# Altium schematic sheet BarGraph.SchDoc
size A
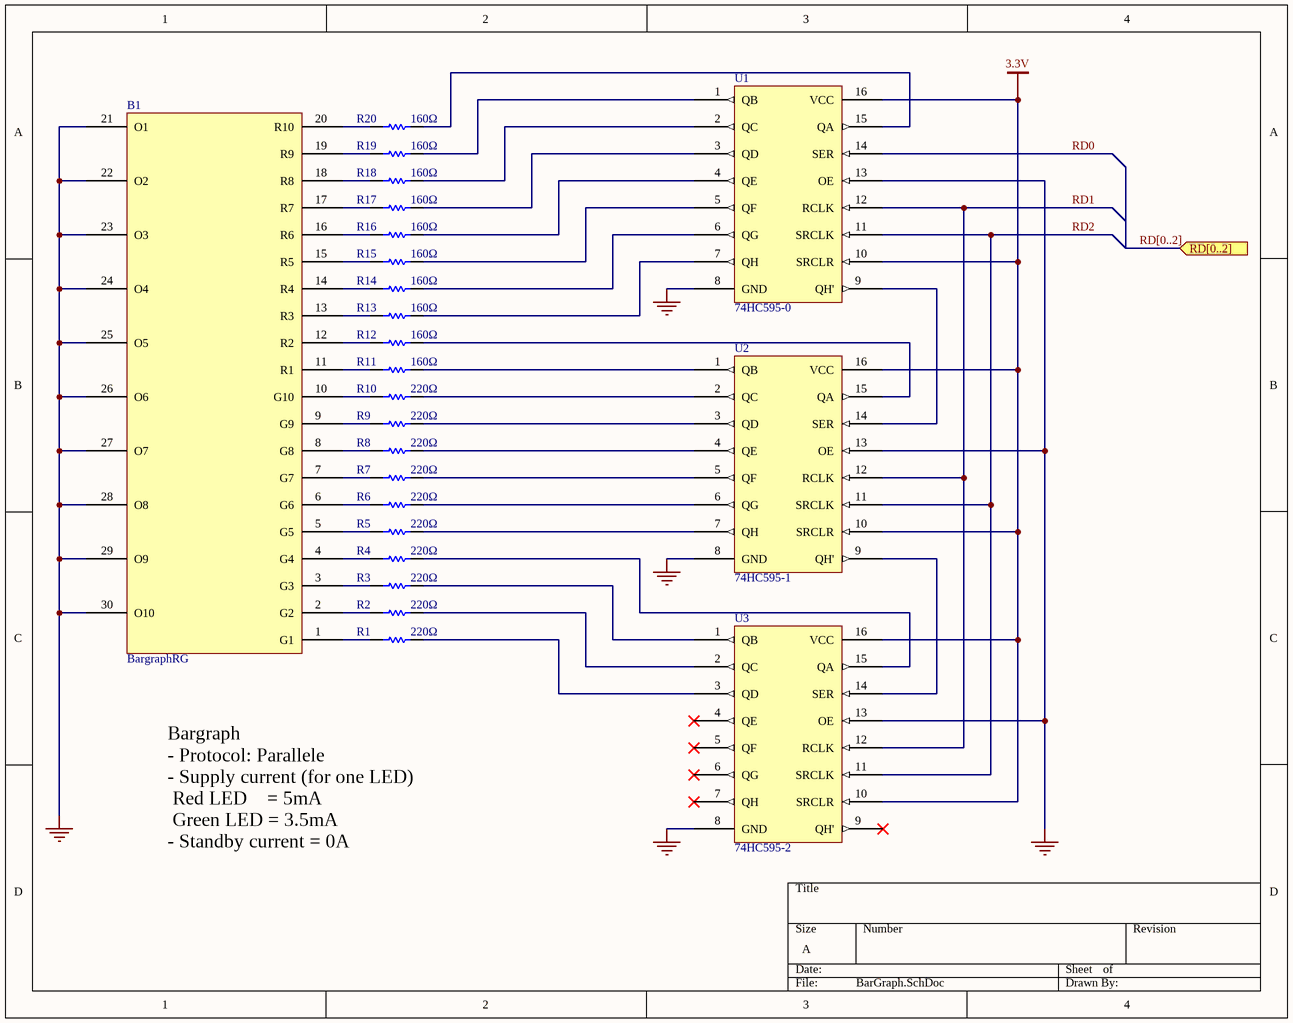
[diagram p0: BarGraph.SchDoc]

## Parts
B1  BargraphRG  [BargraphRG]
R1  220Ω  [R0603]
R2  220Ω  [R0603]
R3  220Ω  [R0603]
R4  220Ω  [R0603]
R5  220Ω  [R0603]
R6  220Ω  [R0603]
R7  220Ω  [R0603]
R8  220Ω  [R0603]
R9  220Ω  [R0603]
R10  220Ω  [R0603]
R11  160Ω  [R0603]
R12  160Ω  [R0603]
R13  160Ω  [R0603]
R14  160Ω  [R0603]
R15  160Ω  [R0603]
R16  160Ω  [R0603]
R17  160Ω  [R0603]
R18  160Ω  [R0603]
R19  160Ω  [R0603]
R20  160Ω  [R0603]
U1  74HC595-0  [SN74HC595D]
U2  74HC595-1  [SN74HC595D]
U3  74HC595-2  [SN74HC595D]

## Ports
RD[0..2] (in)

## Nets
3.3V: U1.10(SRCLR) U1.16(VCC) U2.10(SRCLR) U2.16(VCC) U3.10(SRCLR) U3.16(VCC)
GND: B1.21(O1) B1.22(O2) B1.23(O3) B1.24(O4) B1.25(O5) B1.26(O6) B1.27(O7) B1.28(O8) B1.29(O9) B1.30(O10) U1.8(GND) U1.13(OE) U2.8(GND) U2.13(OE) U3.8(GND) U3.13(OE)
RD0: U1.14(SER)
RD1: U1.12(RCLK) U2.12(RCLK) U3.12(RCLK)
RD2: U1.11(SRCLK) U2.11(SRCLK) U3.11(SRCLK)
NetB1_1: B1.1(G1) R1.1
NetB1_2: B1.2(G2) R2.1
NetB1_3: B1.3(G3) R3.1
NetB1_4: B1.4(G4) R4.1
NetB1_5: B1.5(G5) R5.1
NetB1_6: B1.6(G6) R6.1
NetB1_7: B1.7(G7) R7.1
NetB1_8: B1.8(G8) R8.1
NetB1_9: B1.9(G9) R9.1
NetB1_10: B1.10(G10) R10.1
NetB1_11: B1.11(R1) R11.1
NetB1_12: B1.12(R2) R12.1
NetB1_13: B1.13(R3) R13.1
NetB1_14: B1.14(R4) R14.1
NetB1_15: B1.15(R5) R15.1
NetB1_16: B1.16(R6) R16.1
NetB1_17: B1.17(R7) R17.1
NetB1_18: B1.18(R8) R18.1
NetB1_19: B1.19(R9) R19.1
NetB1_20: B1.20(R10) R20.1
NetR1_2: R1.2 U3.3(QD)
NetR2_2: R2.2 U3.2(QC)
NetR3_2: R3.2 U3.1(QB)
NetR4_2: R4.2 U3.15(QA)
NetR5_2: R5.2 U2.7(QH)
NetR6_2: R6.2 U2.6(QG)
NetR7_2: R7.2 U2.5(QF)
NetR8_2: R8.2 U2.4(QE)
NetR9_2: R9.2 U2.3(QD)
NetR10_2: R10.2 U2.2(QC)
NetR11_2: R11.2 U2.1(QB)
NetR12_2: R12.2 U2.15(QA)
NetR13_2: R13.2 U1.7(QH)
NetR14_2: R14.2 U1.6(QG)
NetR15_2: R15.2 U1.5(QF)
NetR16_2: R16.2 U1.4(QE)
NetR17_2: R17.2 U1.3(QD)
NetR18_2: R18.2 U1.2(QC)
NetR19_2: R19.2 U1.1(QB)
NetR20_2: R20.2 U1.15(QA)
NetU1_9: U1.9(QH') U2.14(SER)
NetU2_9: U2.9(QH') U3.14(SER)

Not connected (* = marked no-connect by the designer): U3 4(QE)* 5(QF)* 6(QG)* 7(QH)* 9(QH')*

## Buses and harness runs
bus RD[0..2] = port RD[0..2]

## Notes on the sheet
- Bargraph
  - Protocol: Parallele
  - Supply current (for one LED)
  Red LED    = 5mA
  Green LED = 3.5mA
  - Standby current = 0A

## Library data of the parts
B1 = BargraphRG: Bargraph; Manufacturer: KINGBRIGHT; Ref.Manufacturer: DC-10EGWA; Ref.Farnell: 2290326; Supplier: Farnell
R1-R20 = Res1: Resistor; Value: 1K; Published: 8-Jun-2000; LatestRevisionDate: 17-Jul-2002; LatestRevisionNote: Re-released for DXP Platform.; PackageReference: AXIAL-0.3; Publisher: Altium Limited; PackageDescription: Axial Device, Thru-Hole; 2 Leads; 0.3 in Pin Spacing; Supplier: Farnell
U1-U3 = 74HC595: ShiftRegister; Manufacturer: TEXAS INSTRUMENTS; Ref.Manufacturer: SN74HC595DR; Ref.Farnell: 1607849; Supplier: Farnell